# Altium schematic sheet MAX14921_AFE.SchDoc
size A4; Organization: TESLA Motors, INC; Address1: 3500 Deer Creek Road; Address2: Palo Alto, CA; Address4: U.S.A.; SheetNumber: 3; SheetTotal: 10
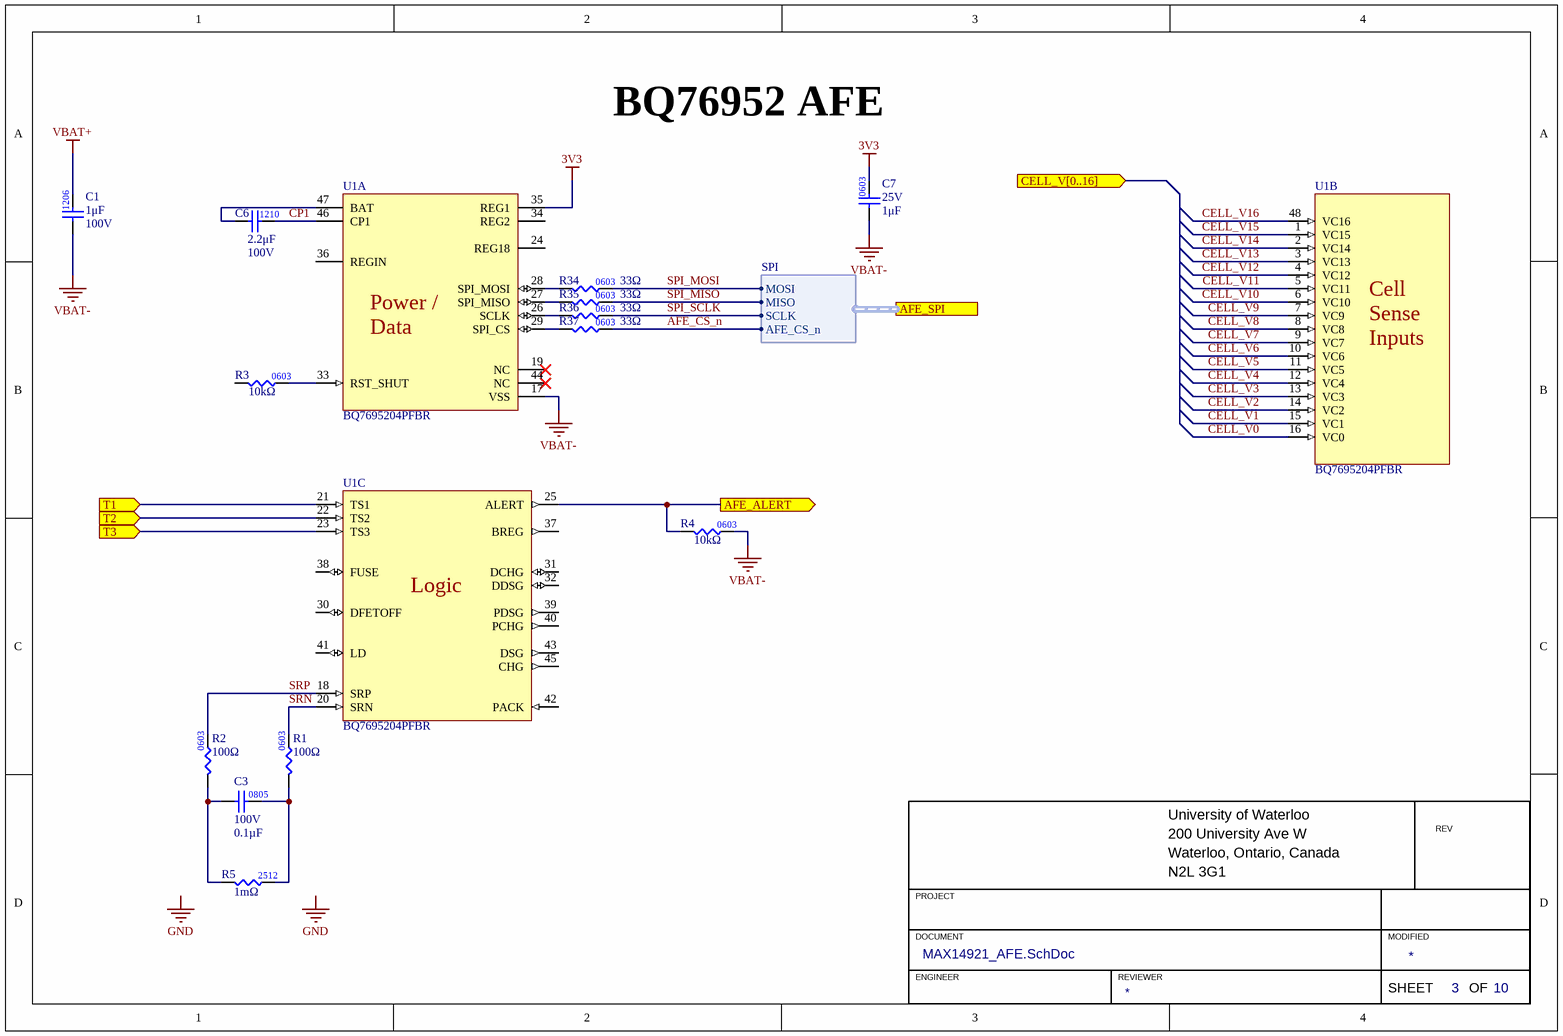
[diagram p0: MAX14921_AFE.SchDoc]

## Parts
C1  value 1μF  Voltage Rating: 100V  [CAP1206]  (hidden comment: CAP_1uF_100V_1206)
C3  value 0.1µF  Voltage Rating: 100V  [CAP0805]  (hidden comment: CAP_0.1uF_100V_0805)
C6  value 2.2μF  Voltage Rating: 100V  [CAP1210]  (hidden comment: CAP_2.2uF_100V_1210)
C7  value 1μF  Voltage Rating: 25V  [CAP0603]  (hidden comment: CAP_1uF_25V_0603)
R1  value 100Ω  [RES0603]  (hidden comment: RES_100Ω_0603_1%)
R2  value 100Ω  [RES0603]  (hidden comment: RES_100Ω_0603_1%)
R3  value 10kΩ  [RES0603]  (hidden comment: RES_10kΩ_0603_1%)
R4  value 10kΩ  [RES0603]  (hidden comment: RES_10kΩ_0603_1%)
R5  value 1mΩ  [RESC6532X75N]  (hidden comment: RES_1mΩ_2512_1%)
R34  value 33Ω  [RES0603]  (hidden comment: RES_33Ω_0603_1%)
R35  value 33Ω  [RES0603]  (hidden comment: RES_33Ω_0603_1%)
R36  value 33Ω  [RES0603]  (hidden comment: RES_33Ω_0603_1%)
R37  value 33Ω  [RES0603]  (hidden comment: RES_33Ω_0603_1%)
U1  BQ7695204PFBR  [TI_48-TQFP]  (parts A,B,C of 3)

## Ports
AFE_ALERT (out), AFE_SPI (harness SPI), CELL_V[0..16] (in), T1 (in), T2 (in), T3 (in)

## Harnesses
SPI: MOSI, MISO, SCLK, AFE_CS_n

## Nets
3V3: C7.2 U1.35(REG1)
VBAT+: C1.2
VBAT-: C1.1 C7.1 R4.2 U1.17(VSS)
AFE_ALERT: R4.1 U1.25(ALERT) ; port AFE_ALERT
AFE_CS_n: R37.2 ; port AFE_SPI.AFE_CS_n
CELL_V0: U1.16(VC0)
CELL_V1: U1.15(VC1)
CELL_V2: U1.14(VC2)
CELL_V3: U1.13(VC3)
CELL_V4: U1.12(VC4)
CELL_V5: U1.11(VC5)
CELL_V6: U1.10(VC6)
CELL_V7: U1.9(VC7)
CELL_V8: U1.8(VC8)
CELL_V9: U1.7(VC9)
CELL_V10: U1.6(VC10)
CELL_V11: U1.5(VC11)
CELL_V12: U1.4(VC12)
CELL_V13: U1.3(VC13)
CELL_V14: U1.2(VC14)
CELL_V15: U1.1(VC15)
CELL_V16: U1.48(VC16)
CP1: C6.2 U1.46(CP1)
SPI_MISO: R35.2 ; port AFE_SPI.MISO
SPI_MOSI: R34.2 ; port AFE_SPI.MOSI
SPI_SCLK: R36.2 ; port AFE_SPI.SCLK
SRN: R1.2 U1.20(SRN)
SRP: R2.2 U1.18(SRP)
T1: U1.21(TS1) ; port T1
T2: U1.22(TS2) ; port T2
T3: U1.23(TS3) ; port T3
NetC3_1: C3.1 R2.1 R5.1
NetC3_2: C3.2 R1.1 R5.2
NetC6_1: C6.1 U1.47(BAT)
NetR3_2: R3.2 U1.33(RST_SHUT)
NetR34_1: R34.1 U1.28(SPI_MOSI)
NetR35_1: R35.1 U1.27(SPI_MISO)
NetR36_1: R36.1 U1.26(SCLK)
NetR37_1: R37.1 U1.29(SPI_CS)

Not connected (* = marked no-connect by the designer): R3 1; U1 19(NC)* 24(REG18) 30(DFETOFF) 31(DCHG) 32(DDSG) 34(REG2) 36(REGIN) 37(BREG) 38(FUSE) 39(PDSG) 40(PCHG) 41(LD) 42(PACK) 43(DSG) 44(NC)* 45(CHG)

## Notes on the sheet
- BQ76952 AFE
- University of Waterloo
- 200 University Ave W
- REV
- PROJECT
- Waterloo, Ontario, Canada
- N2L 3G1
- DOCUMENT
- ENGINEER
- REVIEWER
- MODIFIED
- SHEET
- OF
- Labels drawn without touching a wire or pin: GND
- (in symbol BQ7695204PFBR, part A) Power / / Data
- (in symbol BQ7695204PFBR, part B) Cell / Sense / Inputs
- (in symbol BQ7695204PFBR, part C) Logic
- (in symbol CAP_2.2uF_100V_1210) 1210
- (in symbol RES_100Ω_0603_1%) 0603

## Library data of the parts
C1 = CAP_1uF_100V_1206: CAP CER 1UF 100V X7R 1206; Supplier 1: Digi-Key; Mounting Type: SMD; Package: 1206; Supplier Part Number 1: 490-16468-1-ND
C3 = CAP_0.1uF_100V_0805: CAP CER 0.1UF 100V X7R 0805; Manufacturer 1: TDK Corporation; Manufacturer Part Number 1: C2012X7R2A104K125AA; Package: 0805; Supplier 1: Digi-Key; Supplier Part Number 1: 445-1418-1-ND
C6 = CAP_2.2uF_100V_1210: CAP CER 2.2UF 100V X7R 1210; Manufacturer 1: Taiyo Yuden; Manufacturer Part Number 1: HMK325B7225KMHP; Dielectric: X7R; Supplier 1: Digi-Key; Supplier Part Number 1: 587-5396-1-ND
C7 = CAP_1uF_25V_0603: CAP CER 1UF 25V X5R 0603; Manufacturer 1: Samsung; Manufacturer Part Number 1: CL10A105KA8NNNC; Supplier 1: Digi-Key; Mounting Type: SMD; Package: 0603; Supplier Part Number 1: 1276-1102-1-ND; Dielectric: X5R
R1 R2 = RES_100Ω_0603_1%: RES 100 OHM 1% 1/10W 0603; Manufacturer 1: Yageo; Manufacturer Part Number 1: RC0603FR-07100RL; Supplier Part Number 1: 311-100HRCT-ND; Supplier 1: Digi-Key
R3 R4 = RES_10kΩ_0603_1%: RES 10K OHM 1% 1/8W 0603; Manufacturer 1: Stackpole Electronics Inc; Manufacturer Part Number 1: RNCP0603FTD10K0; Supplier Part Number 1: RNCP0603FTD10K0CT-ND; Supplier 1: Digi-Key; Mounting Type: SMD; Package: 0603
R5 = RES_1mΩ_2512_1%: RES 1 mOHM 1% 3W 2512; Manufacturer 1: Riedon; Manufacturer Part Number 1: CSRL3-0R001F8; Supplier 1: Digi-Key; Supplier Part Number 1: 696-1834-1-ND; Mounting Type: SMD; Package: 2512
R34-R37 = RES_33Ω_0603_1%: RES 33 OHM 1% 1/10W 0603; Manufacturer 1: Vishay; Manufacturer Part Number 1: CRCW060333R0FKEA; Supplier 1: Digi-Key; Mounting Type: SMD; Supplier Part Number 1: 541-33.0HCT-ND; Package: 0603
U1 = BQ7695204PFBR: IC BAT LIFEPO4/LI-ION 3-16C TQFP; Manufacturer 1: Texas Instruments; Package/Footprint: 48-TQFP; Manufacturer Part Number 1: BQ7695204PFBR; Supplier 1: Digi-Key; Supplier Part Number 1: 296-BQ7695204PFBRCT-ND